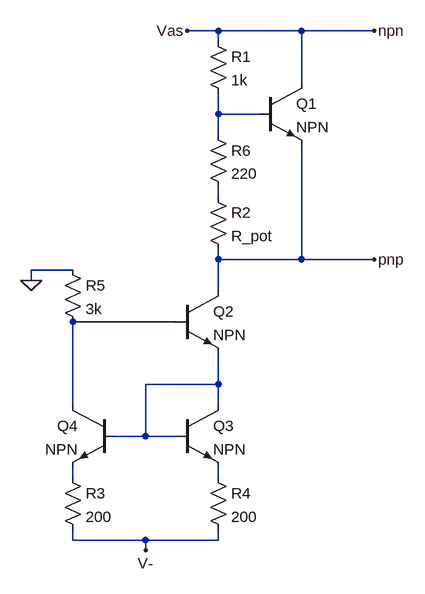
[diagram p0: schematic bias_current_final.asc]
bias_current_final.asc, the LTspice schematic file:
Version 4
SHEET 1 880 840
WIRE 160 -32 112 -32
WIRE 288 -32 160 -32
WIRE 400 -32 288 -32
WIRE 160 -16 160 -32
WIRE 288 48 288 -32
WIRE 160 96 160 64
WIRE 224 96 160 96
WIRE 160 128 160 96
WIRE 160 224 160 208
WIRE 160 320 160 304
WIRE 288 320 288 144
WIRE 288 320 160 320
WIRE 400 320 288 320
WIRE -64 336 -128 336
WIRE -128 352 -128 336
WIRE 160 368 160 320
WIRE 96 416 -64 416
WIRE 160 512 160 464
WIRE 160 512 48 512
WIRE -64 544 -64 416
WIRE 160 544 160 512
WIRE 48 592 48 512
WIRE 48 592 0 592
WIRE 96 592 48 592
WIRE -64 656 -64 640
WIRE 160 656 160 640
WIRE -64 752 -64 736
WIRE 48 752 -64 752
WIRE 160 752 160 736
WIRE 160 752 48 752
WIRE 48 768 48 752
FLAG 112 -32 Vas
FLAG 400 320 pnp
FLAG 400 -32 npn
FLAG -128 352 0
FLAG 48 768 V-
SYMBOL res 144 -32 R0
SYMATTR InstName R1
SYMATTR Value 1k
SYMBOL npn 224 48 R0
SYMATTR InstName Q1
SYMBOL npn 96 368 R0
SYMATTR InstName Q2
SYMBOL npn 96 544 R0
SYMATTR InstName Q3
SYMBOL npn 0 544 M0
SYMATTR InstName Q4
SYMBOL res -80 640 R0
SYMATTR InstName R3
SYMATTR Value 200
SYMBOL res 144 640 R0
SYMATTR InstName R4
SYMATTR Value 200
SYMBOL res -80 320 R0
SYMATTR InstName R5
SYMATTR Value 3k
SYMBOL res 144 208 R0
SYMATTR InstName R2
SYMATTR Value R_pot
SYMBOL res 144 112 R0
SYMATTR InstName R6
SYMATTR Value 220

The netlist it stands for:
* bias_current_final.asc
R1 npn N001 1k
Q1 npn N001 pnp 0 NPN
Q2 pnp N003 N004 0 NPN
Q3 N004 N004 N006 0 NPN
Q4 N003 N004 N005 0 NPN
R3 N005 V- 200
R4 N006 V- 200
R5 0 N003 3k
R2 N002 pnp R_pot
R6 N001 N002 220
.model NPN NPN
.model PNP PNP
.lib standard.bjt
.backanno
.end